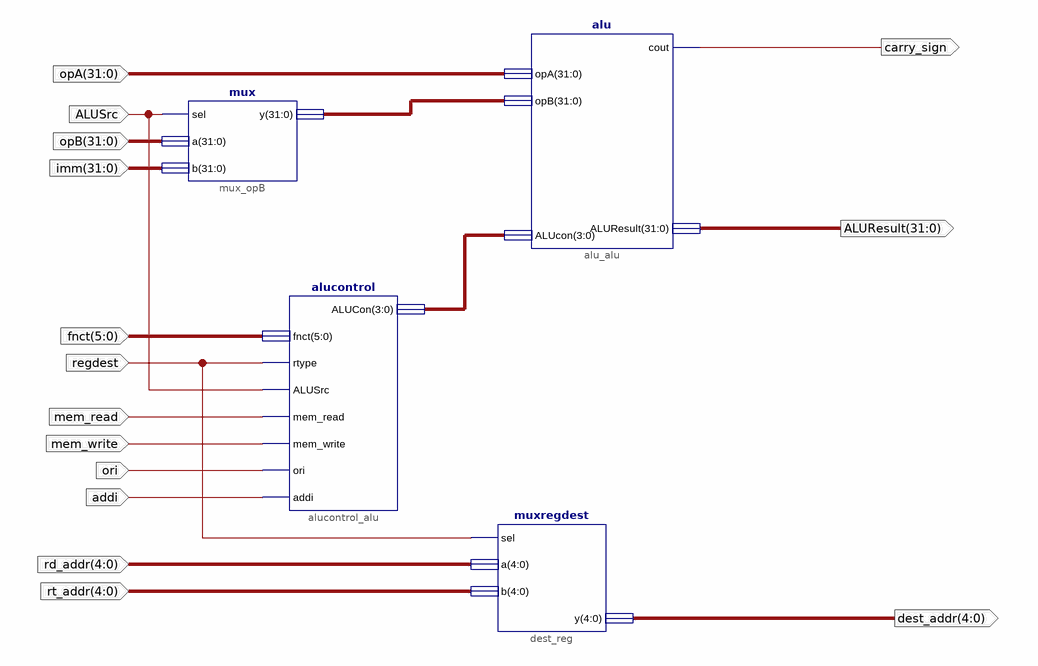
[diagram p0: schematic sheet 1]
// Xilinx ISE schematic alu_top.sch (spartan3a) as structural Verilog: 4 symbols, 15 ports
module alu_top (
  input  [31:0] opA,
  input  ALUSrc,
  input  [31:0] opB,
  input  [31:0] imm,
  input  [5:0] fnct,
  input  regdest,
  input  mem_read,
  input  mem_write,
  input  ori,
  input  addi,
  input  [4:0] rd_addr,
  input  [4:0] rt_addr,
  output [31:0] ALUResult,
  output [4:0] dest_addr,
  output carry_sign
);

  wire [3:0] XLXN_4;
  wire [31:0] XLXN_3;

  alu alu_alu (.opA(opA), .opB(XLXN_3), .ALUcon(XLXN_4), .cout(carry_sign), .ALUResult(ALUResult));
  mux mux_opB (.sel(ALUSrc), .a(opB), .b(imm), .y(XLXN_3));
  muxregdest dest_reg (.sel(regdest), .a(rd_addr), .b(rt_addr), .y(dest_addr));
  alucontrol alucontrol_alu (
    .rtype(regdest), .ALUSrc(ALUSrc), .mem_read(mem_read), .mem_write(mem_write), .ori(ori), .addi(addi),
    .fnct(fnct), .ALUCon(XLXN_4));
endmodule
